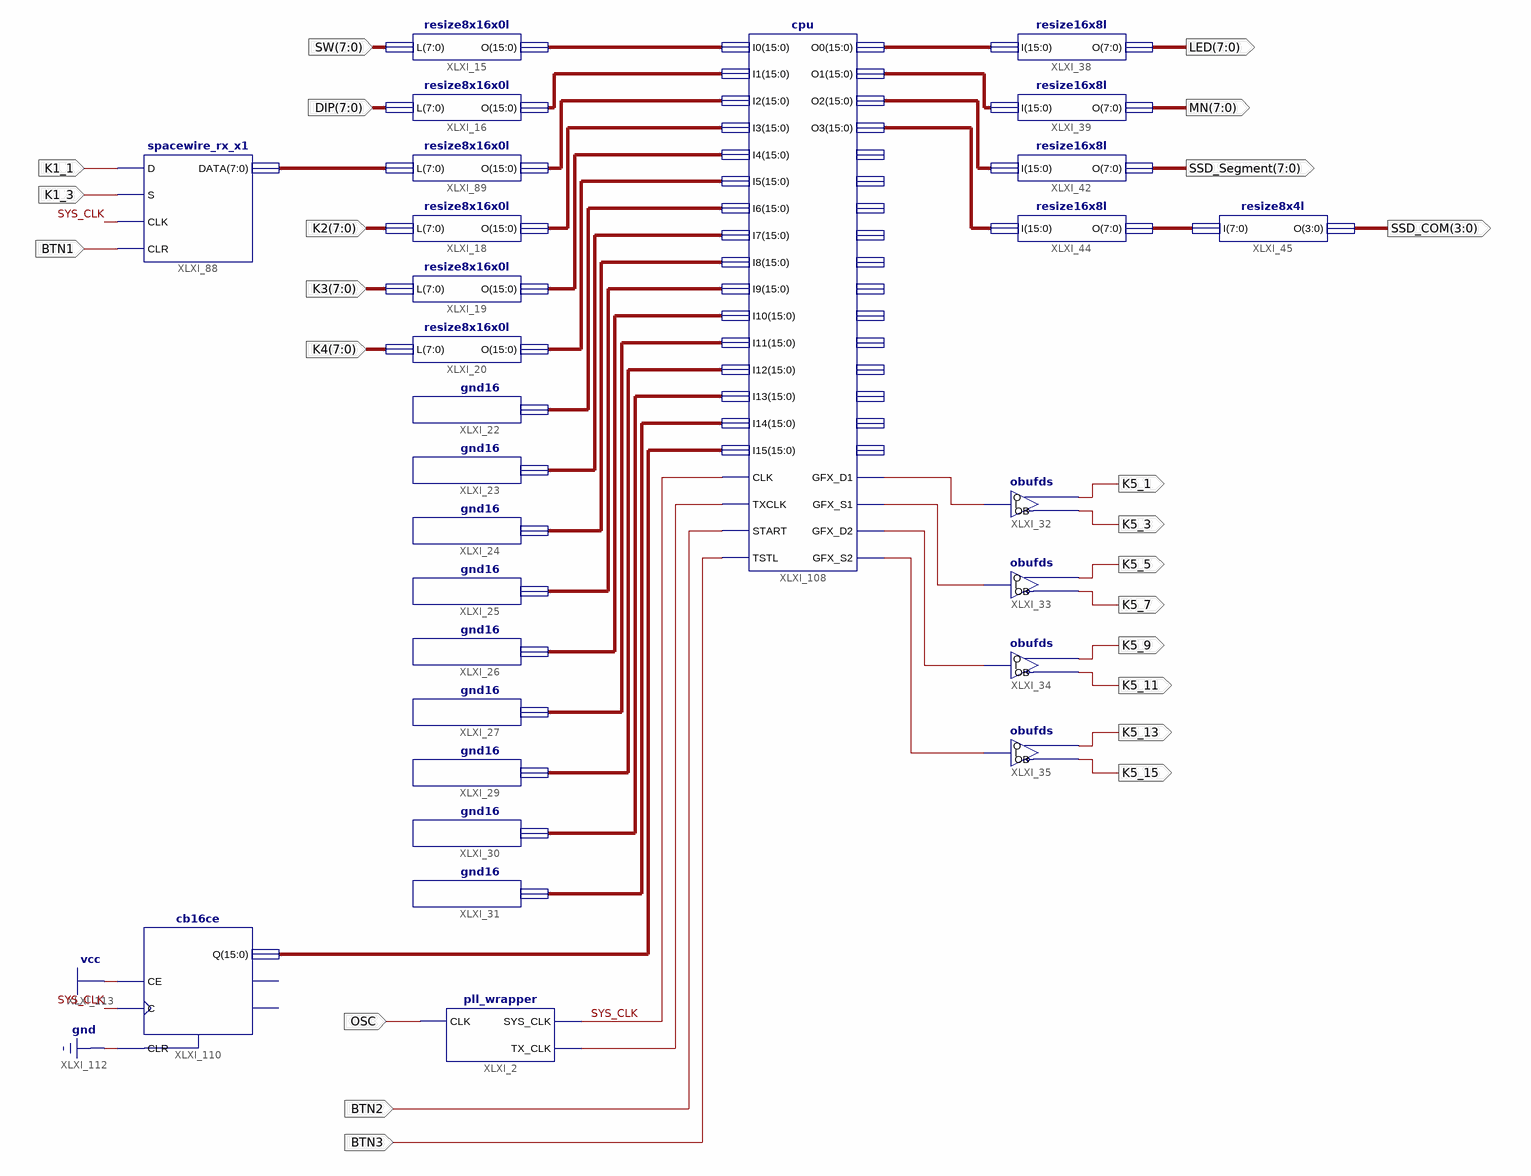
[diagram p0: schematic sheet 1]
// Xilinx ISE schematic main.sch (spartan6) as structural Verilog: 28 symbols, 23 ports
module main (
  input  OSC,
  input  [7:0] SW,
  input  [7:0] DIP,
  input  [7:0] K2,
  input  [7:0] K3,
  input  [7:0] K4,
  input  BTN2,
  input  BTN3,
  input  K1_1,
  input  K1_3,
  input  BTN1,
  output [7:0] SSD_Segment,
  output [3:0] SSD_COM,
  output K5_15,
  output K5_13,
  output K5_11,
  output K5_9,
  output K5_7,
  output K5_5,
  output K5_3,
  output K5_1,
  output [7:0] LED,
  output [7:0] MN
);

  wire SYS_CLK, XLXN_2, XLXN_225, XLXN_226, XLXN_227, XLXN_228;
  wire [7:0] XLXN_91, XLXN_116;
  wire [15:0] XLXN_83, XLXN_84, XLXN_85, XLXN_86, XLXN_98, XLXN_99, XLXN_101, XLXN_103, XLXN_104, XLXN_105,
       XLXN_106, XLXN_107, XLXN_108, XLXN_109, XLXN_110, XLXN_111, XLXN_112, XLXN_113, XLXN_114, XLXN_115;

  pll_wrapper XLXI_2 (.CLK(OSC), .SYS_CLK(SYS_CLK), .TX_CLK(XLXN_2));
  resize8x16x0l XLXI_15 (.L(SW), .O(XLXN_98));
  resize8x16x0l XLXI_16 (.L(DIP), .O(XLXN_99));
  resize8x16x0l XLXI_18 (.L(K2), .O(XLXN_101));
  resize8x16x0l XLXI_19 (.L(K3), .O(XLXN_103));
  resize8x16x0l XLXI_20 (.L(K4), .O(XLXN_104));
  gnd16 XLXI_22 (.GNDO(XLXN_105));
  gnd16 XLXI_23 (.GNDO(XLXN_106));
  gnd16 XLXI_24 (.GNDO(XLXN_107));
  gnd16 XLXI_25 (.GNDO(XLXN_108));
  gnd16 XLXI_27 (.GNDO(XLXN_110));
  gnd16 XLXI_26 (.GNDO(XLXN_109));
  gnd16 XLXI_29 (.GNDO(XLXN_111));
  gnd16 XLXI_30 (.GNDO(XLXN_112));
  gnd16 XLXI_31 (.GNDO(XLXN_113));
  resize16x8l XLXI_38 (.I(XLXN_83), .O(LED));
  resize16x8l XLXI_39 (.I(XLXN_84), .O(MN));
  resize16x8l XLXI_42 (.I(XLXN_85), .O(SSD_Segment));
  resize16x8l XLXI_44 (.I(XLXN_86), .O(XLXN_91));
  resize8x4l XLXI_45 (.I(XLXN_91), .O(SSD_COM));
  resize8x16x0l XLXI_89 (.L(XLXN_116), .O(XLXN_115));
  spacewire_rx_x1 XLXI_88 (.CLK(SYS_CLK), .CLR(BTN1), .D(K1_1), .DATA(XLXN_116), .S(K1_3));
  obufds XLXI_35 (.I(XLXN_225), .O(K5_13), .OB(K5_15));
  obufds XLXI_34 (.I(XLXN_226), .O(K5_9), .OB(K5_11));
  obufds XLXI_33 (.I(XLXN_227), .O(K5_5), .OB(K5_7));
  obufds XLXI_32 (.I(XLXN_228), .O(K5_1), .OB(K5_3));
  cb16ce XLXI_110 (.C(SYS_CLK), .CE(1'b1), .CLR(1'b0), .Q(XLXN_114));  // open: CEO, TC
  cpu XLXI_108 (
    .CLK(SYS_CLK), .GFX_D1(XLXN_228), .GFX_D2(XLXN_226), .GFX_S1(XLXN_227), .GFX_S2(XLXN_225), .I0(XLXN_98),
    .I1(XLXN_99), .I10(XLXN_109), .I11(XLXN_110), .I12(XLXN_111), .I13(XLXN_112), .I14(XLXN_113),
    .I15(XLXN_114), .I2(XLXN_115), .I3(XLXN_101), .I4(XLXN_103), .I5(XLXN_104), .I6(XLXN_105), .I7(XLXN_106),
    .I8(XLXN_107), .I9(XLXN_108), .O0(XLXN_83), .O1(XLXN_84), .O2(XLXN_85), .O3(XLXN_86), .START(BTN2),
    .TSTL(BTN3), .TXCLK(XLXN_2));  // open: O10, O11, O12, O13, O14, O15, O4, O5, O6, O7, O8, O9
endmodule
